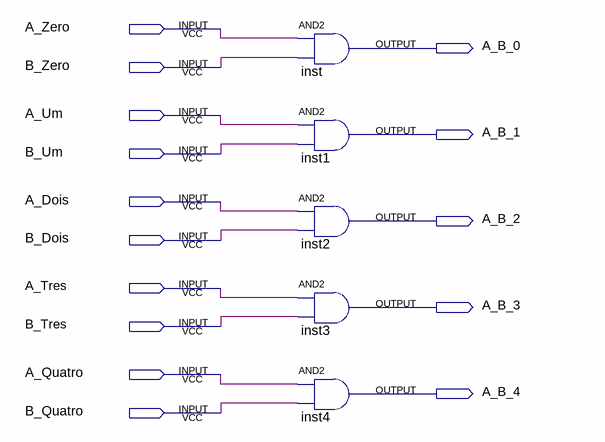
[diagram p0: schematic sheet]
// Quartus schematic A_And_B.bdf as structural Verilog: 5 symbols, 15 pins
module A_And_B (
  input  A_Zero,
  input  B_Zero,
  input  A_Um,
  input  B_Um,
  input  A_Dois,
  input  B_Dois,
  input  A_Tres,
  input  B_Tres,
  input  A_Quatro,
  input  B_Quatro,
  output A_B_0,
  output A_B_1,
  output A_B_2,
  output A_B_3,
  output A_B_4
);

  and inst (A_B_0, A_Zero, B_Zero);
  and inst1 (A_B_1, A_Um, B_Um);
  and inst2 (A_B_2, A_Dois, B_Dois);
  and inst3 (A_B_3, A_Tres, B_Tres);
  and inst4 (A_B_4, A_Quatro, B_Quatro);
endmodule
